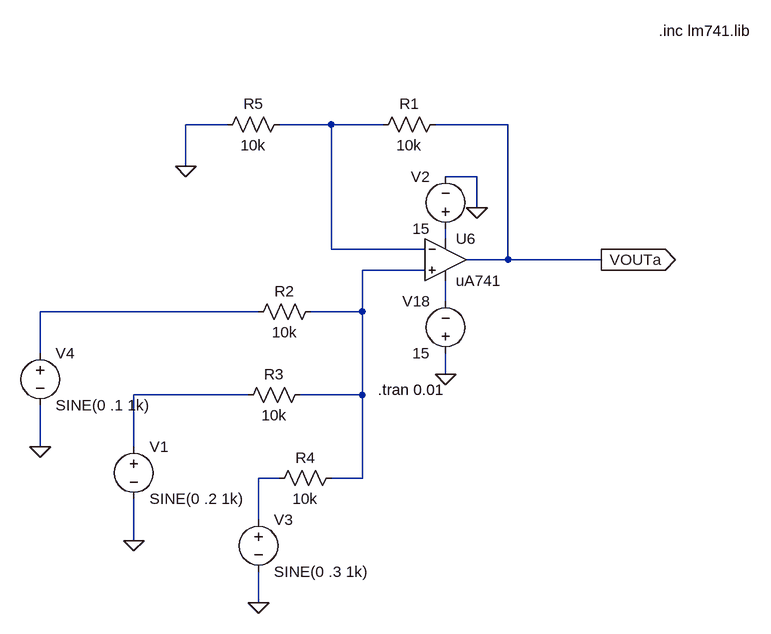
[diagram p0: schematic addercircuits_noninverting.asc]
addercircuits_noninverting.asc, the LTspice schematic file:
Version 4.1
SHEET 1 4784 2492
WIRE 512 1248 448 1248
WIRE 672 1248 592 1248
WIRE 752 1248 672 1248
WIRE 944 1248 832 1248
WIRE 448 1312 448 1248
WIRE 896 1328 848 1328
WIRE 896 1376 896 1328
WIRE 848 1424 848 1408
WIRE 672 1440 672 1248
WIRE 816 1440 672 1440
WIRE 944 1456 944 1248
WIRE 944 1456 880 1456
WIRE 1088 1456 944 1456
WIRE 816 1472 720 1472
WIRE 848 1520 848 1488
WIRE 560 1536 224 1536
WIRE 720 1536 720 1472
WIRE 720 1536 640 1536
WIRE 224 1600 224 1536
WIRE 848 1632 848 1600
WIRE 544 1664 368 1664
WIRE 720 1664 720 1536
WIRE 720 1664 624 1664
WIRE 224 1744 224 1680
WIRE 368 1744 368 1664
WIRE 592 1792 560 1792
WIRE 720 1792 720 1664
WIRE 720 1792 672 1792
WIRE 560 1856 560 1792
WIRE 368 1888 368 1824
WIRE 560 1984 560 1936
FLAG 848 1632 0
FLAG 1088 1456 VOUTa
IOPIN 1088 1456 Out
FLAG 896 1376 0
FLAG 560 1984 0
FLAG 368 1888 0
FLAG 224 1744 0
FLAG 448 1312 0
SYMBOL OpAmps\\opamp2 848 1392 R0
SYMATTR InstName U6
SYMATTR Value uA741
SYMBOL voltage 848 1616 R180
WINDOW 0 24 96 Left 2
WINDOW 3 24 16 Left 2
WINDOW 123 0 0 Left 0
WINDOW 39 0 0 Left 0
SYMATTR InstName V18
SYMATTR Value 15
SYMBOL voltage 848 1424 R180
WINDOW 0 24 96 Left 2
WINDOW 3 24 16 Left 2
WINDOW 123 0 0 Left 0
WINDOW 39 0 0 Left 0
SYMATTR InstName V2
SYMATTR Value 15
SYMBOL res 656 1520 R90
WINDOW 0 0 56 VBottom 2
WINDOW 3 32 56 VTop 2
SYMATTR InstName R2
SYMATTR Value 10k
SYMBOL res 848 1232 R90
WINDOW 0 0 56 VBottom 2
WINDOW 3 32 56 VTop 2
SYMATTR InstName R1
SYMATTR Value 10k
SYMBOL res 640 1648 R90
WINDOW 0 0 56 VBottom 2
WINDOW 3 32 56 VTop 2
SYMATTR InstName R3
SYMATTR Value 10k
SYMBOL res 688 1776 R90
WINDOW 0 0 56 VBottom 2
WINDOW 3 32 56 VTop 2
SYMATTR InstName R4
SYMATTR Value 10k
SYMBOL voltage 368 1728 R0
WINDOW 123 0 0 Left 0
WINDOW 39 0 0 Left 0
SYMATTR InstName V1
SYMATTR Value SINE(0 .2 1k)
SYMBOL voltage 560 1840 R0
WINDOW 123 0 0 Left 0
WINDOW 39 0 0 Left 0
SYMATTR InstName V3
SYMATTR Value SINE(0 .3 1k)
SYMBOL voltage 224 1584 R0
WINDOW 123 0 0 Left 0
WINDOW 39 0 0 Left 0
SYMATTR InstName V4
SYMATTR Value SINE(0 .1 1k)
SYMBOL res 608 1232 R90
WINDOW 0 0 56 VBottom 2
WINDOW 3 32 56 VTop 2
SYMATTR InstName R5
SYMATTR Value 10k
TEXT 744 1656 Left 2 !.tran 0.01
TEXT 1176 1104 Left 2 !.inc lm741.lib

The netlist it stands for:
* addercircuits_noninverting.asc
X§U6 N003 N001 N002 N004 VOUTa uA741  ; pins In+ In- V+ V- OUT
V18 0 N004 15
V2 N002 0 15
R2 N003 N005 10k
R1 VOUTa N001 10k
R3 N003 N006 10k
R4 N003 N007 10k
V1 N006 0 SINE(0 .2 1k)
V3 N007 0 SINE(0 .3 1k)
V4 N005 0 SINE(0 .1 1k)
R5 N001 0 10k
.tran 0.01
.inc lm741.lib
.backanno
.end